# Altium project PCB_Project.PrjPcb
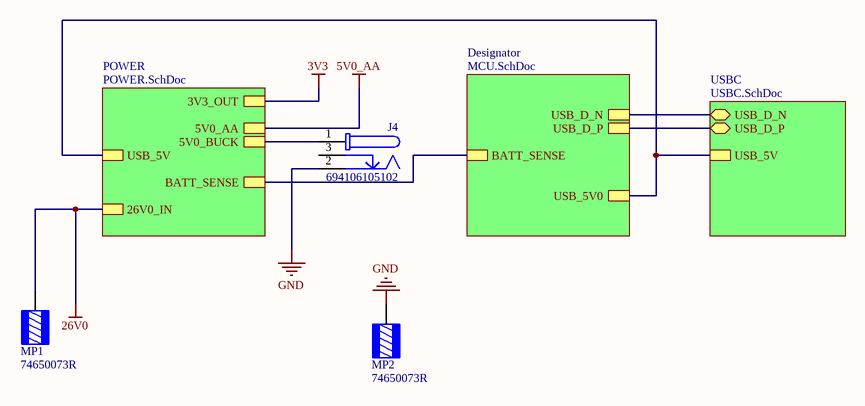
[diagram p0: TOP.SchDoc]
CAGE_CODE: ?????; CONTRACT_NUMBER: <CONTRACT NO>; DOC_NO_ASSY_DWG: <ASSY DWG NO>; DOC_NO_BOM: <BOM DOC NO>; DOC_NO_FAB_DWG: <FAB DWG NO>; DOC_NO_SCH_DWG: <SCH DWG NO>; PCB_2_DEC_TOL: +/-.01; PCB_3_DEC_TOL: +/-.010; PCB_ANG_TOL: +/-1/2; PCB_ASSEMBLY_NO: <PCB ASSY NO>; PCB_CHECKER: - -----; PCB_CHECKER_APP_DATE: --/--/----; PCB_DESIGNER: - -----; PCB_DESIGNER_APP_DATE: --/--/----; PCB_DWG_NO: <PCB DWG NO>; PCB_ENGINEER: - -----; PCB_ENGINEER_APP_DATE: --/--/----; PCB_PART_NUMBER: <PCB PN>; PCB_REV: A; SCH_REV: A
4 sheets, 64 parts. Net scope: hierarchical (ports join the sheet entries above them; power ports are global).
Board file: PCB1.PcbDoc
Sheets:
  TOP.SchDoc
    POWER = POWER.SchDoc
    Designator = MCU.SchDoc
    USBC = USBC.SchDoc

## Sheet TOP.SchDoc
size A4; SheetNumber: 1; SheetTotal: 4

### Parts
J4  694106105102  [694106105102]
MP1  74650073R  [WURTH 74650073]
MP2  74650073R  [WURTH 74650073]

### Sub-sheets
Designator = MCU.SchDoc: USB_D_N, USB_D_P, USB_5V0, BATT_SENSE
POWER = POWER.SchDoc: 26V0_IN, 5V0_AA, 3V3_OUT, USB_5V, BATT_SENSE, 5V0_BUCK
USBC = USBC.SchDoc: USB_D_N (bidir), USB_D_P (bidir), USB_5V

### Nets
26V0: MP1.1 ; sheet POWER/26V0_IN
GND: J4.2 MP2.1
5V_BUCK: J4.1 ; sheet POWER/5V0_BUCK
5V_USB: sheet POWER/USB_5V, sheet Designator/USB_5V0, sheet USBC/USB_5V
USB_D_N: sheet Designator/USB_D_N, sheet USBC/USB_D_N
USB_D_P: sheet Designator/USB_D_P, sheet USBC/USB_D_P
NetRbot_1: sheet POWER/BATT_SENSE, sheet Designator/BATT_SENSE

Not connected (* = marked no-connect by the designer): J4 3

### Library data of the parts
J4 = CMP-1502-00176-3: DC Power Jack Connector with Pegs WR-DC, Male, Right Angled, SMT, 5 A, 24 V; Voltage Rating: 24V; Insulation Resistance: 100MΩ; Current Rating: 5A; Shielding: Unshielded; Number of Contacts: 3; Contact Gender: Female; Min Operating Temperature: -40°C; REACH SVHC: Unknown; Flammability Rating: UL94 V-0; Contact Material: Gold; Housing Material: Polyamide; Operating Supply Voltage: 24V; Mount: Surface Mount; Packaging: Tape and Reel; Max Operating Temperature: 85°C; Termination: SMD/SMT; Height: 11.2mm; Voltage Rating (DC): 24V; Contact Plating: Tin; Connector Type: Power; Color: Black; Gender: Male; RoHS: Compliant
MP1 MP2 = 74650073R: TERM REDCUBE M3 4PIN PCB; Manufacturer: Würth Elektronik; Current Rating (Amps): 50 A; Part Number: 74650073R; ComponentLink1Description: Datasheet; ComponentLink1URL: https://katalog.we-online.de/em/datasheet/74650073R.pdf; ComponentLink2Description: DigiKey Link; ComponentLink2URL: https://www.digikey.com/en/products/detail/würth-elektronik/74650073R/6643978; Features: Screw not Included; LastUpdated: 8/7/2022 8:38:54 PM; Lifecycle Status: Active; Minimum Order: 1; Mounting Type: Through Hole; Number of Pins: 4; Packaging: TapeAndReel; Part Status: Active; Price: 2.28; Screw Size: M3; Series: REDCUBE WP-THRBU; Supplier 1: DigiKey; Supplier Part Number 1: 732-10882-1-ND; Terminal Type: Screw Terminal, Power Tap; Termination: Solder

## Sheet POWER.SchDoc
size A4; SheetNumber: 2; SheetTotal: 4
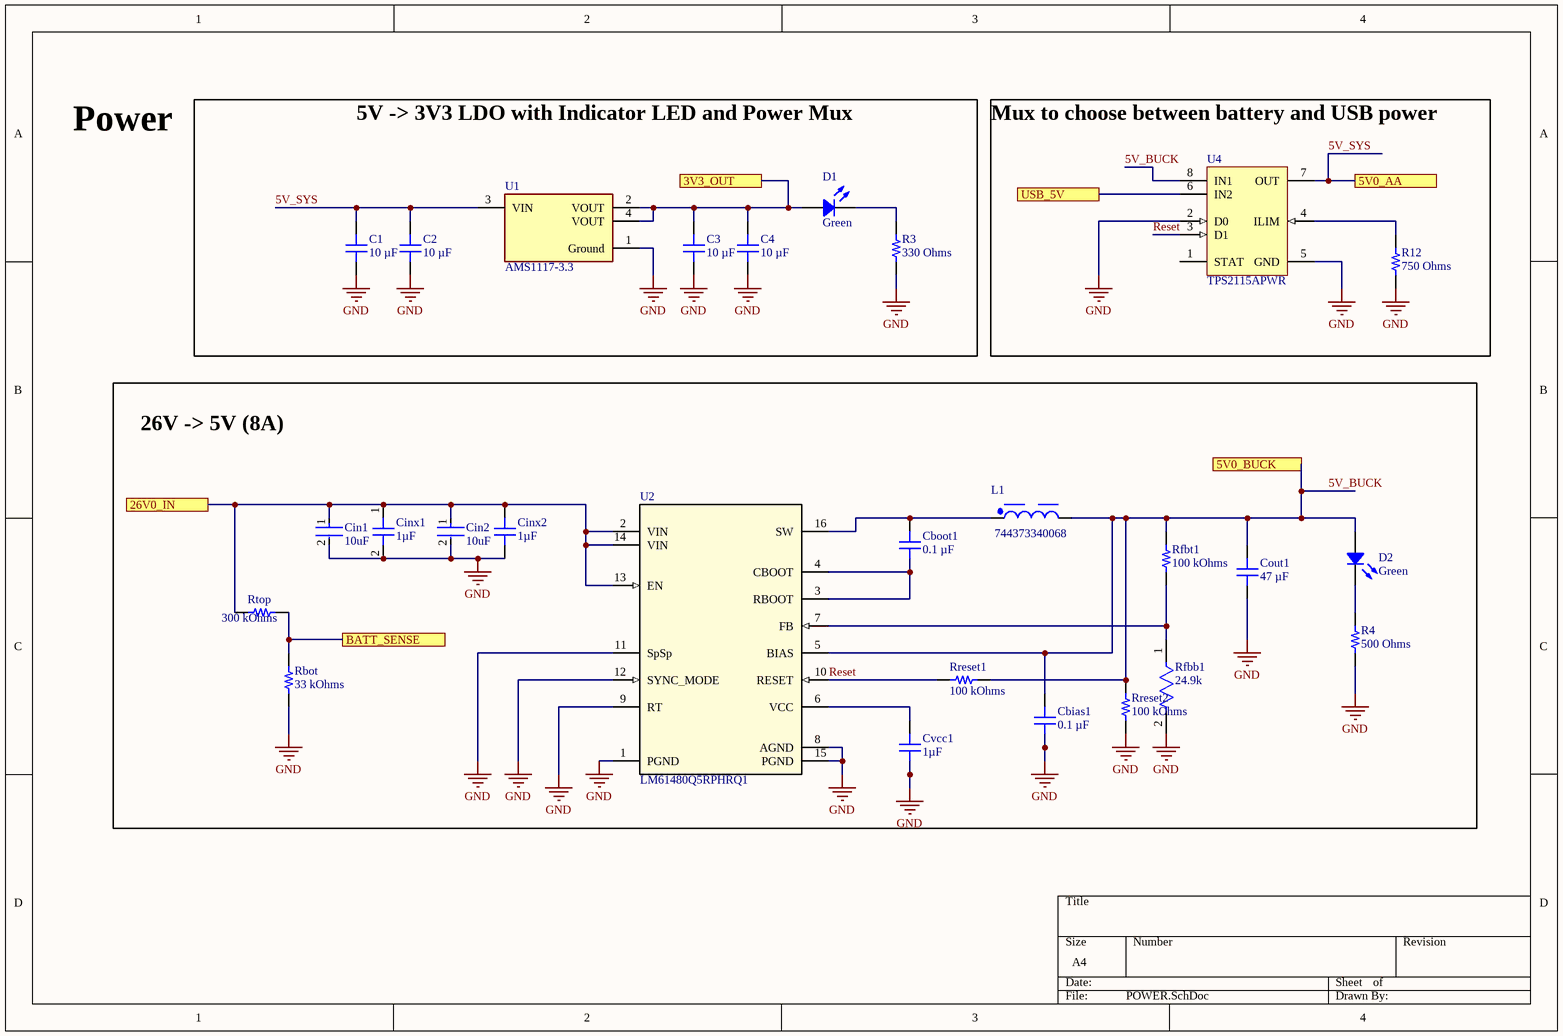
[diagram p1: POWER.SchDoc]

### Parts
C1  10 µF  [CAP 0603_1608]
C2  10 µF  [CAP 0603_1608]
C3  10 µF  [CAP 0603_1608]
C4  10 µF  [CAP 0603_1608]
Cbias1  0.1 µF  [CAP 0603_1608]
Cboot1  0.1 µF  [CAP 0603_1608]
Cin1  10uF  [FP-GRT31C-0_2-IPC_A]
Cin2  10uF  [FP-GRT31C-0_2-IPC_A]
Cinx1  1µF  [CAP 0603_1608]
Cinx2  1µF  [CAP 0603_1608]
Cout1  47 µF  [CAP 0603_1608]
Cvcc1  1µF  [CAP 0603_1608]
D1  Green  [LED 0603_1608 GREEN]
D2  Green  [LED 0603_1608 GREEN]
L1  744373340068  [WE-LHMI_5020]
R3  330 Ohms  [RES 0603_1608]
R4  500 Ohms  [RES 1206_3216]
R12  750 Ohms  [RES 0603_1608]
Rbot  33 kOhms  [YAGEO RES 0603_1608]
Rfbb1  24.9k  [FP-TFCR0603-IPC_A]
Rfbt1  100 kOhms  [RES 0603_1608]
Rreset1  100 kOhms  [RES 0603_1608]
Rreset2  100 kOhms  [RES 0603_1608]
Rtop  300 kOhms  [YAGEO RES 0603_1608]
U1  AMS1117-3.3  [FP-AMS1117-IPC_C]
U2  LM61480Q5RPHRQ1  [RPH0016A]
U4  TPS2115APWR  [PW0008A_N]

### Blocks framed on the sheet
5V -> 3V3 LDO with Indicator LED and Power Mux: C1-C4 D1 R3 U1
Mux to choose between battery and USB power: R12 U4
26V -> 5V (8A): Cbias1 Cboot1 Cin1 Cin2 Cinx1 Cinx2 Cout1 Cvcc1 D2 L1 R4 Rbot Rfbb1 Rfbt1 Rreset1 Rreset2 Rtop U2

### Ports
3V3_OUT, 5V0_AA, 5V0_BUCK, 26V0_IN, BATT_SENSE, USB_5V

### Nets
3V3: C3.2 C4.2 D1.1 U1.2(VOUT) U1.4(VOUT) ; port 3V3_OUT
5V_SYS: C1.2 C2.2 U1.3(VIN) U4.7(OUT) ; port 5V0_AA
26V0: Cin1.1 Cin2.1 Cinx1.1 Cinx2.1 Rtop.1 U2.2(VIN) U2.13(EN) U2.14(VIN) ; port 26V0_IN
GND: C1.1 C2.1 C3.1 C4.1 Cbias1.2 Cin1.2 Cin2.2 Cinx1.2 Cinx2.2 Cout1.2 Cvcc1.2 R3.1 R4.2 R12.2 Rbot.2 Rfbb1.2 Rreset2.2 U1.1(Ground) U2.1(PGND) U2.8(AGND) U2.9(RT) U2.11(SpSp) U2.12(SYNC_MODE) U2.15(PGND) U4.2(D0) U4.5(GND)
5V_BUCK: Cbias1.1 Cout1.1 D2.1 L1.2 Rfbt1.1 Rreset1.2 Rreset2.1 U2.5(BIAS) U4.8(IN1) ; port 5V0_BUCK
5V_USB: U4.6(IN2) ; port USB_5V
Reset: Rreset1.1 U2.10(RESET) U4.3(D1)
NetCboot1_1: Cboot1.1 L1.1 U2.16(SW)
NetCboot1_2: Cboot1.2 U2.3(RBOOT) U2.4(CBOOT)
NetCvcc1_1: Cvcc1.1 U2.6(VCC)
NetD1_2: D1.2 R3.2
NetD2_2: D2.2 R4.1
NetR12_1: R12.1 U4.4(ILIM)
NetRbot_1: Rbot.1 Rtop.2 ; port BATT_SENSE
NetRfbb1_1: Rfbb1.1 Rfbt1.2 U2.7(FB)

Not connected (* = marked no-connect by the designer): U4 1(STAT)

### Notes on the sheet
- Power

### Library data of the parts
C1-C4 = CM105X5R106K16AT: 0603 X5R 10UF10% 16V; manufacturer: KYOCERA AVX; Tolerance: ±10%; Part Number: CM105X5R106K16AT; Value: 10 µF; Applications: General Purpose; Capacitance: 10 µF; componentlink1description: Datasheet; componentlink1url: https://ele.kyocera.com/assets/products/capacitor/CM_Series_e.pdf; componentlink2description: DigiKey Link; componentlink2url: https://www.digikey.com/en/products/detail/kyocera-avx/CM105X5R106K16AT/17866311; Device Package: 0603 (1608 Metric); lastupdated: 2/9/2024 8:08:53 PM; Lifecycle Status: Active; Minimum Order: 1; Mounting Type: Surface Mount, MLCC; Operating Temperature: -55°C ~ 85°C; Package / Case: 0603 (1608 Metric); packaging: TapeAndReel; partid: 55416; Part Status: Active; price: 0.03; series: CM; Size / Dimension: 0.063" L x 0.031" W (1.60mm x 0.80mm); Supplier 1: DigiKey; Supplier Part Number 1: 478-CM105X5R106K16ATCT-ND; Temperature Coefficient: X5R; Thickness (Max): 0.039" (1.00mm); Voltage - Rated: 16V
Cbias1 Cboot1 = C0603C104K5RAC7411: CAP CER 0.1UF 50V X7R 0603; manufacturer: KEMET; Tolerance: ±10%; Part Number: C0603C104K5RAC7411; Capacitance: 0.1 µF; Applications: Bypass, Decoupling; componentlink1description: Datasheet; componentlink1url: https://api.kemet.com/component-edge/download/datasheet/C0603C104K5RAC7411.pdf; componentlink2description: DigiKey Link; componentlink2url: https://www.digikey.com/en/products/detail/kemet/C0603C104K5RAC7411/3317013; Device Package: 0603 (1608 Metric); lastupdated: 2024-02-09 8:10:30 PM; Lifecycle Status: Active; Minimum Order: 1; Mounting Type: Surface Mount, MLCC; Operating Temperature: -55°C ~ 125°C; Package / Case: 0603 (1608 Metric); packaging: TapeAndReel; partid: 2233; Part Status: Active; price: 0.01; series: SMD Comm X7R; Size / Dimension: 0.063" L x 0.031" W (1.60mm x 0.80mm); Supplier 1: DigiKey; Supplier Part Number 1: 399-C0603C104K5RAC7411CT-ND; Temperature Coefficient: X7R; Thickness (Max): 0.035" (0.90mm); value: 0.1 µF; Voltage - Rated: 50V
Cin1 Cin2 = CMP-06035-048951-1: CAP CER 10UF 50V X5R 1206; Tolerance: 20%; Length: 0.126inch; Mount: Surface Mount; Packaging: Tape and Reel; Capacitance: 10uF; Case/Package: 1206; Case Code (Imperial): 1206; Max Operating Temperature: 85°C; Voltage Rating: 50V; Ratings: AEC-Q200; Min Operating Temperature: -55°C; Thickness: 0.071inch; Width: 0.063inch; Case Code (Metric): 3216
Cinx1 Cinx2 Cvcc1 = 06035D105MAT2A: CAP CER 1UF 50V X5R 0603; manufacturer: AVX Corporation; Tolerance: ±20%; Part Number: 06035D105MAT2A; Capacitance: 1µF; Applications: General Purpose; componentlink1description: Datasheet; componentlink1url: http://datasheets.avx.com/cx5r.pdf; componentlink2description: DigiKey Link; componentlink2url: http://digikey.com/product-detail/en/avx-corporation/06035D105MAT2A/478-11443-1-ND/8019298; Device Package: 0603 (1608 Metric); lastupdated: 2020-09-02 1:03:34 AM; Lifecycle Status: Active; Minimum Order: 1; Mounting Type: Surface Mount, MLCC; Operating Temperature: -55°C ~ 85°C; Package / Case: 0603 (1608 Metric); packaging: TapeAndReel; partid: 3200; Part Status: Active; price: 0.05; series: -; Size / Dimension: 0.063" L x 0.032" W (1.60mm x 0.81mm); Supplier 1: DigiKey; Supplier Part Number 1: 478-11443-1-ND; Temperature Coefficient: X5R; Thickness (Max): 0.035" (0.90mm); value: 1µF; Voltage - Rated: 50V
Cout1 = CL10A476MQ8QRNC: CAP CER 47UF 6.3V X5R 0603; manufacturer: Samsung Electro-Mechanics; Tolerance: ±20%; Part Number: CL10A476MQ8QRNC; Capacitance: 47 µF; Applications: General Purpose; componentlink1description: Datasheet; componentlink1url: https://media.digikey.com/pdf/Data%20Sheets/Samsung%20PDFs/CL10A476MQ8QRNC_Spec.pdf; componentlink2description: DigiKey Link; componentlink2url: https://www.digikey.com/en/products/detail/samsung-electro-mechanics/CL10A476MQ8QRNC/10478988; Device Package: 0603 (1608 Metric); lastupdated: 2024-02-09 8:09:49 PM; Lifecycle Status: Active; Minimum Order: 1; Mounting Type: Surface Mount, MLCC; Operating Temperature: -55°C ~ 85°C; Package / Case: 0603 (1608 Metric); packaging: TapeAndReel; partid: 45940; Part Status: Active; price: 0.29; series: CL; Size / Dimension: 0.063" L x 0.031" W (1.60mm x 0.80mm); Supplier 1: DigiKey; Supplier Part Number 1: 1276-CL10A476MQ8QRNCCT-ND; Temperature Coefficient: X5R; Thickness (Max): 0.039" (1.00mm); value: 47 µF; Voltage - Rated: 6.3V
D1 D2 = 150060GS75003: LED GREEN CLEAR 0603 SMD; Manufacturer: Würth Elektronik; Current - Test: 20mA; Lens Color: Colorless; Lens Size: 1.10mm x 0.80mm; Lens Style: Rectangle with Flat Top; Millicandela Rating: 1600mcd; Viewing Angle: 140°; Voltage - Forward (Vf) (Typ): 3.2V; Wavelength - Dominant: 525nm; Wavelength - Peak: 515nm; Part Number: 150060GS75003; Color: Green; ComponentLink1Description: Datasheet; ComponentLink1URL: https://www.we-online.com/catalog/datasheet/150060GS75003.pdf; ComponentLink2Description: DigiKey Link; ComponentLink2URL: https://www.digikey.com/en/products/detail/würth-elektronik/150060GS75003/16022170; Device Package: 0603 (1608 Metric); Height (Max): 0.80mm; LastUpdated: 6/3/2024 7:58:49 PM; Lens Transparency: Clear; Lifecycle Status: Active; Minimum Order: 1; Mounting Type: Surface Mount; Package / Case: 0603 (1608 Metric); Packaging: TapeAndReel; PartId: 1111; Part Status: Active; Price: 0.18; Series: WL-SMCW; Size / Dimension: 1.60mm L x 0.80mm W; Supplier 1: DigiKey; Supplier Part Number 1: 732-150060GS75003CT-ND; Supplier Device Package: 0603; Value: Green
L1 = CMP-03913-52738382-5: We-lhmi Series, Shielded Wire-wound SMD Inductor 680 Nh +/-20% Wire-wound 6.8A I; Tolerance: 20%; Test Frequency: 100kHz; Inductance: 680nH; Self Resonant Frequency: 90MHz; Saturation Current: 9.8A; DC Resistance (DCR): 11mΩ; Core Material: Ferrite; Width: 5.2mm; Shielding: Shielded; Current Rating: 6.8A; REACH SVHC: Unknown; RMS Current (Irms): 6.8A; Max Operating Temperature: 125°C; Termination: SMD/SMT; Ambient Temperature Range Low: -40°C; Composition: Wirewound; Height: 1.8mm; Mount: Surface Mount; Max DC Current: 6.8A; Number of Pins: 2; Height - Seated (Max): 1.9812mm; Length: 5.7mm; Case/Package: SMD/SMT; Ambient Temperature Range High: 85°C; Inductance Tolerance: 20%; Min Operating Temperature: -40°C; RoHS: Compliant
R3 = ERA-3VEB3300V: RES 330 OHM 0.1% 1/8W 0603; Manufacturer: Panasonic Electronic Components; Power (Watts): 0.125W, 1/8W; Temperature Coefficient: ±25ppm/°C; Part Number: ERA-3VEB3300V; Value: 330 Ohms; ComponentLink1Description: Datasheet; ComponentLink1URL: https://b2b-api.panasonic.eu/file_stream/pids/fileversion/9152; ComponentLink2Description: DigiKey Link; ComponentLink2URL: https://www.digikey.com/en/products/detail/panasonic-electronic-components/ERA-3VEB3300V/12085193; Composition: Thin Film; Device Package: 0603 (1608 Metric); Features: Anti-Sulfur, Automotive AEC-Q200; Height - Seated (Max): 0.022" (0.55mm); LastUpdated: 2/9/2024 8:41:22 PM; Lifecycle Status: Active; Minimum Order: 1; Number of Terminations: 2; Operating Temperature: -55°C ~ 155°C; Package / Case: 0603 (1608 Metric); Packaging: TapeAndReel; PartId: 62303; Part Status: Active; Price: 0.10; Ratings: AEC-Q200; Resistance: 330 Ohms; Series: ERA-3V; Size / Dimension: 0.063" L x 0.031" W (1.60mm x 0.80mm); Supplier 1: DigiKey; Supplier Part Number 1: 10-ERA-3VEB3300VCT-ND; Supplier Device Package: 0603; Tolerance: ±0.1%
R4 = PLT1206Z5000AST5: RES SMD 500 OHM 0.05% 0.4W 1206; Manufacturer: Vishay Thin Film; Power (Watts): 0.4W, 2/5W; Temperature Coefficient: ±5ppm/°C; Part Number: PLT1206Z5000AST5; ComponentLink1Description: Datasheet; ComponentLink1URL: http://www.vishay.com/docs/60030/plt.pdf; ComponentLink2Description: DigiKey Link; ComponentLink2URL: http://digikey.com/product-detail/en/vishay-thin-film/PLT1206Z5000AST5/PLT1206-500ACT-ND/2120427; Composition: Thin Film; Device Package: 1206 (3216 Metric); Features: Anti-Corrosive, Flame Proof, Moisture Resistant, Safety; Height - Seated (Max): 0.033" (0.84mm); LastUpdated: 2024-02-09 8:54:28 PM; Lifecycle Status: Active; Minimum Order: 1; Number of Terminations: 2; Operating Temperature: -55°C ~ 125°C; Package / Case: 1206 (3216 Metric); Packaging: TapeAndReel; PartId: 30946; Part Status: Active; Price: 2.64; Resistance: 500 Ohms; Series: PLT; Size / Dimension: 0.126" L x 0.063" W (3.20mm x 1.60mm); Supplier 1: DigiKey; Supplier Part Number 1: PLT1206-500ACT-ND; Supplier Device Package: 1206; Tolerance: ±0.05%; Value: 500 Ohms
R12 = CPF0603F750RC1: RES SMD 750 OHM 1% 1/16W 0603; Manufacturer: TE Connectivity Passive Product; Power (Watts): 0.063W, 1/16W; Temperature Coefficient: ±50ppm/°C; Part Number: CPF0603F750RC1; Value: 750 Ohms; ComponentLink1Description: Datasheet; ComponentLink1URL: https://www.te.com/commerce/DocumentDelivery/DDEController?Action=srchrtrv&DocNm=1773200&DocType=DS&DocLang=English; ComponentLink2Description: DigiKey Link; ComponentLink2URL: https://www.digikey.com/en/products/detail/te-connectivity-passive-product/CPF0603F750RC1/2384377; Composition: Thin Film; Device Package: 0603 (1608 Metric); Height - Seated (Max): 0.022" (0.55mm); LastUpdated: 2024-02-09 8:43:28 PM; Lifecycle Status: Active; Minimum Order: 1; Number of Terminations: 2; Operating Temperature: -55°C ~ 155°C; Package / Case: 0603 (1608 Metric); Packaging: TapeAndReel; PartId: 7040; Part Status: Active; Price: 0.02; Resistance: 750 Ohms; Series: CPF, Neohm; Size / Dimension: 0.061" L x 0.031" W (1.55mm x 0.80mm); Supplier 1: DigiKey; Supplier Part Number 1: A102316CT-ND; Supplier Device Package: 0603; Tolerance: ±1%
Rbot = RT0603FRE0733KL: RES SMD 33K OHM 1% 1/10W 0603; Manufacturer: Yageo; Power (Watts): 0.1W, 1/10W; Temperature Coefficient: ±50ppm/°C; Part Number: RT0603FRE0733KL; Value: 33 kOhms; ComponentLink1Description: Datasheet; ComponentLink1URL: https://www.yageo.com/upload/media/product/productsearch/datasheet/rchip/PYu-RT_1-to-0.01_RoHS_L_11.pdf; ComponentLink2Description: DigiKey Link; ComponentLink2URL: https://www.digikey.com/en/products/detail/yageo/RT0603FRE0733KL/1075313; Composition: Thin Film; Device Package: 0603 (1608 Metric); Height - Seated (Max): 0.022" (0.55mm); LastUpdated: 2024-07-25 9:19:32 AM; Lifecycle Status: Active; Minimum Order: 1; Number of Terminations: 2; Operating Temperature: -55°C ~ 155°C; Package / Case: 0603 (1608 Metric); Packaging: TapeAndReel; PartId: 5680; Part Status: Active; Price: 0.01; Resistance: 33 kOhms; Series: RT; Size / Dimension: 0.063" L x 0.031" W (1.60mm x 0.80mm); Supplier 1: DigiKey; Supplier Part Number 1: YAG5959CT-ND; Supplier Device Package: 0603; Tolerance: ±1%
Rfbb1 = CMP-250906-231724-1: RES Thin Film,  24.9kΩ, 1%, 0.1W, 50ppm/°C, 0603
Rfbt1 Rreset1 Rreset2 = RNCS0603BKE100K: RES 100K OHM 0.1% 1/16W 0603; Manufacturer: Stackpole Electronics Inc; Power (Watts): 0.063W, 1/16W; Temperature Coefficient: ±25ppm/°C; Part Number: RNCS0603BKE100K; Value: 100 kOhms; ComponentLink1Description: Datasheet; ComponentLink1URL: https://www.seielect.com/catalog/sei-rncs_rnch.pdf; ComponentLink2Description: DigiKey Link; ComponentLink2URL: https://www.digikey.com/en/products/detail/stackpole-electronics-inc/RNCS0603BKE100K/1708835; Composition: Thin Film; Device Package: 0603 (1608 Metric); Features: Anti-Corrosive, Automotive AEC-Q200, Moisture Resistant; Height - Seated (Max): 0.022" (0.55mm); LastUpdated: 2024-02-09 8:43:37 PM; Lifecycle Status: Active; Minimum Order: 1; Number of Terminations: 2; Operating Temperature: -55°C ~ 155°C; Package / Case: 0603 (1608 Metric); Packaging: TapeAndReel; PartId: 4849; Part Status: Active; Price: 0.06; Ratings: AEC-Q200; Resistance: 100 kOhms; Series: RNCS; Size / Dimension: 0.061" L x 0.031" W (1.55mm x 0.80mm); Supplier 1: DigiKey; Supplier Part Number 1: RNCS0603BKE100KCT-ND; Supplier Device Package: 0603; Tolerance: ±0.1%
Rtop = RC0603FR-07300KL: RES 300K OHM 1% 1/10W 0603; Manufacturer: Yageo; Power (Watts): 0.1W, 1/10W; Temperature Coefficient: ±100ppm/°C; Part Number: RC0603FR-07300KL; Value: 300 kOhms; ComponentLink1Description: Datasheet; ComponentLink1URL: https://www.yageo.com/upload/media/product/productsearch/datasheet/rchip/PYu-RC_Group_51_RoHS_L_10.pdf; ComponentLink2Description: DigiKey Link; ComponentLink2URL: https://www.digikey.com/en/products/detail/yageo/RC0603FR-07300KL/727145; Composition: Thick Film; Device Package: 0603 (1608 Metric); Features: Moisture Resistant; Height - Seated (Max): 0.022" (0.55mm); LastUpdated: 2024-07-25 9:19:32 AM; Lifecycle Status: Active; Minimum Order: 1; Number of Terminations: 2; Operating Temperature: -55°C ~ 155°C; Package / Case: 0603 (1608 Metric); Packaging: CutTape; PartId: 7517; Part Status: Active; Price: 0.01; Resistance: 300 kOhms; Series: RC_L; Size / Dimension: 0.063" L x 0.031" W (1.60mm x 0.80mm); Supplier 1: DigiKey; Supplier Part Number 1: 311-300KHRCT-ND; Supplier Device Package: 0603; Tolerance: ±1%
U1 = CMP-209535-000001-1: LDO Voltage Regulators 1A, 3.3V; Manufacturer: Advanced Monolithic Systems; Dropout Voltage: 1.1V; Output Type: Fixed; Nominal Supply Current: 5mA; Max Power Dissipation: 1.2W; Max Supply Voltage: 15V; Number Of Outputs: 1; Standoff Height: 0.64mm; Max Junction Temp: +125°C; Height: 1.8mm; Package: AMS1117; Device Class L2: Power Management ICs; ComponentLink2Description: Datasheet; ComponentLink2URL: http://www.advanced-monolithic.com/pdf/ds1117.pdf; Category: IC; RoHS: TRUE; Automotive: No; Device Class L1: Integrated Circuits (ICs); Output Current: 1A; Device Class L3: Voltage Regulators - Linear; Temperature: -40°C to +125°C; Output Voltage: 3.3V; Manufacturer Part Number: AMS1117-3.3; Temperature Range Low: -40°C; Octopart: https://octopart.com/ams1117-3.3-advanced+monolithic+systems-25899300; Lead Free: Yes; Ipc Land Pattern Name: SOT229P700X180-4; Temperature Range High: +125°C
U2 = LM61480Q5RPHRQ1: Automotive 8A buck converter optimized for power density and low EMI 16-VQFN-HR -40 to 150; Manufacturer_Name: Texas Instruments; TYPE: TYPE; RefDes: RefDes; Copyright: Copyright (C) 2025 Ultra Librarian. All rights reserved.; Manufacturer_Part_Number: LM61480Q5RPHRQ1; Supplier 1: DigiKey; Supplier Part Number 1: 296-LM61480Q5RPHRQ1CT-ND
U4 = CMP-0339-00018-2: Dual In / Single Out Autoswitching Power Mux, 2.8 to 5.5 V, -40 to 85 degC, 8-pin TSSOP (PW), Green (RoHS & no Sb/Br); Manufacturer: Texas Instruments; SubFamily: Power Multiplexer (MUX); IN2 rDS(on)(Typ)(Ohms): 0.084; Number of Inputs: 2; IN1, IN2 Input Voltage(Max)(V): 5.5; IN1, IN2 Input Voltage(Min)(V): 2.8; IN1 rDS(on)(Typ)(mOhm): 84; IN2 Output Current(Max)(A): 1.25; PackageDescription: 8-Pin Plastic Thin Small Outline Package 3 x 4.4 mm Body ,0.65 mm Pitch; PackageVersion: revG, Feb-2011; ComponentLink1Description: Datasheet; Mounting Technology: Surface Mount; PartNumber: TPS2115APWR; DatasheetVersion: SBVS044F; Eco-Plan: Green (RoHS & no Sb/Br); Code_JEDEC: MO-153; PackageReference: PW0008A; IN1 Output Current(Max)(A): 1.25; ComponentLink1URL: http://www.ti.com/general/docs/lit/getliterature.tsp?genericPartNumber=TPS2115A&fileType=pdf

## Sheet MCU.SchDoc
size A4; SheetNumber: 4; SheetTotal: 4
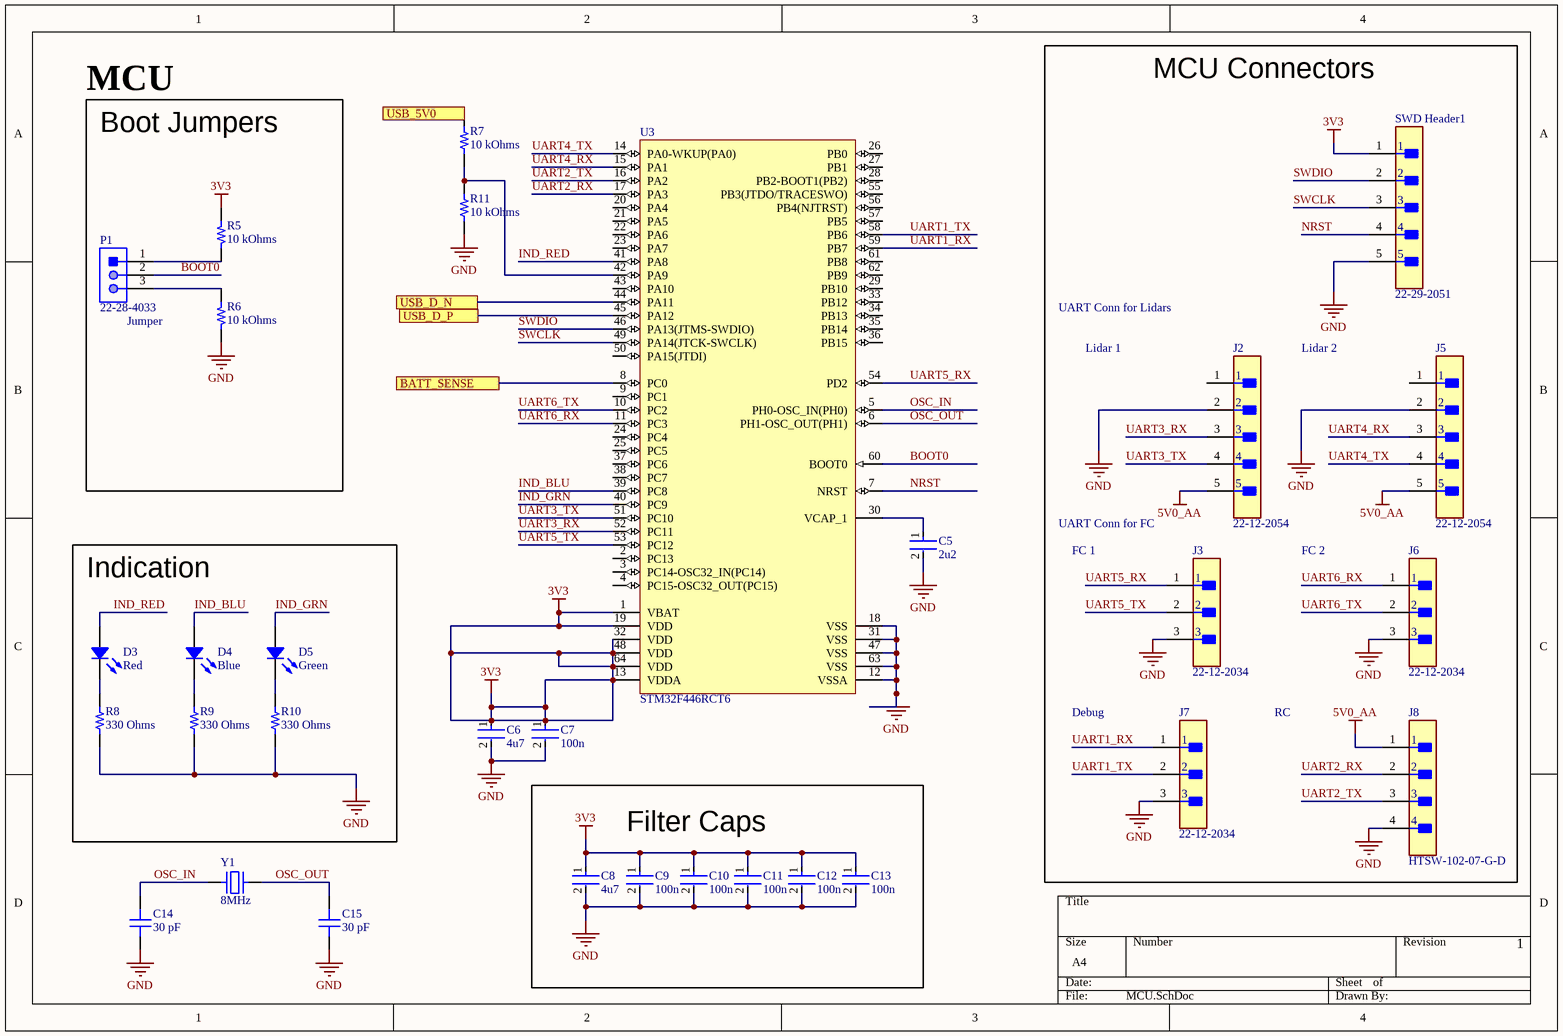
[diagram p2: MCU.SchDoc]

### Parts
C5  2u2  [FP-CL10-IPC_C]
C6  4u7  [FP-CL10-IPC_C]
C7  100n  [FP-CL779-IPC_C]
C8  4u7  [FP-CL10-IPC_C]
C9  100n  [FP-CL779-IPC_C]
C10  100n  [FP-CL779-IPC_C]
C11  100n  [FP-CL779-IPC_C]
C12  100n  [FP-CL779-IPC_C]
C13  100n  [FP-CL779-IPC_C]
C14  30 pF  [CAP 0603_1608]
C15  30 pF  [CAP 0603_1608]
D3  Red  [LED 0603_1608 RED]
D4  Blue  [LED 0603_1608 BLUE]
D5  Green  [LED 0603_1608 GREEN]
J2  22-12-2054  [FP-22-12-2054-MFG]
J3  22-12-2034  [FP-22-12-2034-MFG]
J5  22-12-2054  [FP-22-12-2054-MFG]
J6  22-12-2034  [FP-22-12-2034-MFG]
J7  22-12-2034  [FP-22-12-2034-MFG]
J8  HTSW-102-07-G-D  [FP-HTSW-102-07-G-D-MFG]
P1  22-28-4033  [MOLX-22-28-4033_V]
R5  10 kOhms  [RES 0603_1608]
R6  10 kOhms  [RES 0603_1608]
R7  10 kOhms  [RES 0603_1608]
R8  330 Ohms  [RES 0603_1608]
R9  330 Ohms  [RES 0603_1608]
R10  330 Ohms  [RES 0603_1608]
R11  10 kOhms  [RES 0603_1608]
SWD_Header1  22-29-2051  [FP-22-29-2051-MFG]
U3  STM32F446RCT6  [STM-LQFP64_L]
Y1  8MHz  [TXC 9C]

### Blocks framed on the sheet
MCU Connectors: J2 J3 J5-J8 SWD_Header1
MCU: P1 R5 R6
Indication: D3-D5 R8-R10
Filter Caps: C8-C13

### Ports
BATT_SENSE, USB_5V0, USB_D_N, USB_D_P

### Nets
3V3: C6.1 C7.1 C8.1 C9.1 C10.1 C11.1 C12.1 C13.1 R5.1 SWD_Header1.1 U3.1(VBAT) U3.13(VDDA) U3.19(VDD) U3.32(VDD) U3.48(VDD) U3.64(VDD)
5V0_AA: J2.5 J5.5 J8.1  [project net 5V_SYS]
GND: C5.2 C6.2 C7.2 C8.2 C9.2 C10.2 C11.2 C12.2 C13.2 C14.1 C15.1 J2.2 J3.3 J5.2 J6.3 J7.3 J8.4 R6.1 R8.1 R9.1 R10.1 R11.1 SWD_Header1.5 U3.12(VSSA) U3.18(VSS) U3.31(VSS) U3.47(VSS) U3.63(VSS)
5V_USB: R7.2 ; port USB_5V0
BOOT0: P1.2 U3.60(BOOT0)
IND_BLU: D4.1 U3.39(PC8)
IND_GRN: D5.1 U3.40(PC9)
IND_RED: D3.1 U3.41(PA8)
NRST: SWD_Header1.4 U3.7(NRST)
OSC_IN: C14.2 U3.5(PH0-OSC_IN(PH0)) Y1.1
OSC_OUT: C15.2 U3.6(PH1-OSC_OUT(PH1)) Y1.2
SWCLK: SWD_Header1.3 U3.49(PA14(JTCK-SWCLK))
SWDIO: SWD_Header1.2 U3.46(PA13(JTMS-SWDIO))
UART1_RX: J7.1 U3.59(PB7)
UART1_TX: J7.2 U3.58(PB6)
UART2_RX: J8.2 U3.17(PA3)
UART2_TX: J8.3 U3.16(PA2)
UART3_RX: J2.3 U3.52(PC11)
UART3_TX: J2.4 U3.51(PC10)
UART4_RX: J5.3 U3.15(PA1)
UART4_TX: J5.4 U3.14(PA0-WKUP(PA0))
UART5_RX: J3.1 U3.54(PD2)
UART5_TX: J3.2 U3.53(PC12)
UART6_RX: J6.1 U3.11(PC3)
UART6_TX: J6.2 U3.10(PC2)
USB_D_N: U3.44(PA11) ; port USB_D_N
USB_D_P: U3.45(PA12) ; port USB_D_P
NetC5_1: C5.1 U3.30(VCAP_1)
NetD3_2: D3.2 R8.2
NetD4_2: D4.2 R9.2
NetD5_2: D5.2 R10.2
NetP1_1: P1.1 R5.2
NetP1_3: P1.3 R6.2
NetR7_1: R7.1 R11.2 U3.42(PA9)
NetRbot_1: U3.8(PC0) ; port BATT_SENSE

Not connected (* = marked no-connect by the designer): J2 1; J5 1; U3 2(PC13) 3(PC14-OSC32_IN(PC14)) 4(PC15-OSC32_OUT(PC15)) 9(PC1) 20(PA4) 21(PA5) 22(PA6) 23(PA7) 24(PC4) 25(PC5) 26(PB0) 27(PB1) 28(PB2-BOOT1(PB2)) 29(PB10) 33(PB12) 34(PB13) 35(PB14) 36(PB15) 37(PC6) 38(PC7) 43(PA10) 50(PA15(JTDI)) 55(PB3(JTDO/TRACESWO)) 56(PB4(NJTRST)) 57(PB5) 61(PB8) 62(PB9)

### Notes on the sheet
- Boot Jumpers
- UART Conn for Lidars
- (near P1) Jumper
- Lidar 1
- Lidar 2
- UART Conn for FC
- FC 1
- FC 2
- Debug
- RC
- 1

### Library data of the parts
C5 C6 C8 = CMP-13271-003017-1: Cap Ceramic 4.7uF 10V X5R ±10% Pad SMD 0603 +85°C T/R; Capacitance: 4.7uF; Case/Package: 0603; Packaging: Tape and Reel; Width: 0.031inch; Contact Plating: Tin; Thickness: 0.035inch; Package Quantity: 1; Voltage Rating: 10V; Case Code (Metric): 1608; Case Code (Imperial): 0603; Depth: 0.8mm; Height: 0.8mm; Tolerance: 10%; Max Operating Temperature: 85°C; Length: 1.6mm; Dielectric: X5R; Mount: Surface Mount; Radiation Hardening: No; Min Operating Temperature: -55°C
C7 C9-C13 = CMP-13271-002336-1: Cap Ceramic 100nF 50V X7R ±10% SMD 0402 +125°C Paper T/R
C14 C15 = 0603N300J500CT: CAP CER 30PF 50V C0G/NP0 0603; manufacturer: Walsin Technology Corporation; Temperature Coefficient: C0G, NP0; Tolerance: ±5%; Part Number: 0603N300J500CT; Value: 30 pF; Applications: General Purpose; Capacitance: 30 pF; componentlink1description: Datasheet; componentlink1url: http://www.passivecomponent.com/wp-content/uploads/2018/10/MLCC.pdf; componentlink2description: DigiKey Link; componentlink2url: https://www.digikey.com/en/products/detail/walsin-technology-corporation/0603N300J500CT/9355012; Device Package: 0603 (1608 Metric); lastupdated: 2/9/2024 8:10:20 PM; Lifecycle Status: Active; Minimum Order: 1; Mounting Type: Surface Mount, MLCC; Operating Temperature: -55°C ~ 125°C; Package / Case: 0603 (1608 Metric); packaging: TapeAndReel; partid: 9974; Part Status: Active; price: 0.01; series: -; Size / Dimension: 0.063" L x 0.031" W (1.60mm x 0.80mm); Supplier 1: DigiKey; Supplier Part Number 1: 1292-1515-1-ND; Thickness (Max): 0.034" (0.87mm); Voltage - Rated: 50V
D3 = 19-213SDRC/S259/TR8: LED RED CLEAR 2SMD; Manufacturer: Everlight Electronics Co Ltd; Configuration: Standard; Current - Test: 10mA; Lens Color: Colorless; Lens Size: 1.20mm x 0.80mm; Lens Style: Rectangle with Flat Top; Viewing Angle: 120°; Voltage - Forward (Vf) (Typ): 2V; Wavelength - Peak: 650nm; Part Number: 19-213SDRC/S259/TR8; Color: Red; ComponentLink1Description: Datasheet; ComponentLink1URL: //media.digikey.com/pdf/Data%20Sheets/Everlight%20PDFs/19-213SDRC-S259-TR8.pdf; ComponentLink2Description: DigiKey Link; ComponentLink2URL: http://digikey.com/product-detail/en/everlight-electronics-co-ltd/19-213SDRC-S259-TR8/1080-1580-1-ND/8535303; Device Package: 0603 (1608 Metric); Height (Max): 0.70mm; LastUpdated: 6/3/2024 7:59:48 PM; Lens Transparency: Clear; Lifecycle Status: Active; Minimum Order: 1; Mounting Type: Surface Mount; Package / Case: 0603 (1608 Metric); Packaging: TapeAndReel; PartId: 372; Part Status: Active; Price: 0.06; Series: -; Size / Dimension: 1.60mm L x 0.80mm W; Supplier 1: DigiKey; Supplier Part Number 1: 1080-1580-1-ND; Supplier Device Package: 2-SMD; Value: Red
D4 = 19-213SUBC/S400-A5/S208-2/TR8: LED BLUE CLEAR 2SMD; Manufacturer: Everlight Electronics Co Ltd; Configuration: Standard; Current - Test: 5mA; Lens Color: Colorless; Lens Size: 1.20mm x 0.80mm; Lens Style: Rectangle with Flat Top; Viewing Angle: 120°; Voltage - Forward (Vf) (Typ): 2.9V; Wavelength - Peak: 468nm; Part Number: 19-213SUBC/S400-A5/S208-2/TR8; Color: Blue; ComponentLink1Description: Datasheet; ComponentLink1URL: //media.digikey.com/pdf/Data%20Sheets/Everlight%20PDFs/19-213SUBC-S400-A5-S208-2-TR8.pdf; ComponentLink2Description: DigiKey Link; ComponentLink2URL: https://www.digikey.com/en/products/detail/everlight-electronics-co-ltd/19-213SUBC-S400-A5-S208-2-TR8/8535275; Device Package: 0603 (1608 Metric); Height (Max): 0.70mm; LastUpdated: 6/3/2024 7:57:52 PM; Lens Transparency: Clear; Lifecycle Status: Active; Minimum Order: 1; Mounting Type: Surface Mount; Package / Case: 0603 (1608 Metric); Packaging: TapeAndReel; PartId: 808; Part Status: Active; Price: 0.05; Series: -; Size / Dimension: 1.60mm L x 0.80mm W; Supplier 1: DigiKey; Supplier Part Number 1: 1080-1581-1-ND; Supplier Device Package: 2-SMD; Value: Blue
D5 = 150060GS55040: LED GREEN DIFFUSED 0603 SMD; Manufacturer: Würth Elektronik; Configuration: Standard; Current - Test: 20mA; Lens Color: 0.50mm; Lens Size: 1.00mm x 0.80mm; Lens Style: Rectangle with Flat Top; Millicandela Rating: 430mcd; Viewing Angle: 140°; Voltage - Forward (Vf) (Typ): 3.2V; Wavelength - Dominant: 525nm; Wavelength - Peak: 520nm; Part Number: 150060GS55040; Color: Green; ComponentLink1Description: Datasheet; ComponentLink1URL: https://www.we-online.de/web/en/index.php/download/media/07_electronic_components/download_center_1/application_notes_berichte/ano002_leds___the_future_of_horticultural_lighting/ANO002b_EN_LEDs_The_Future_of_Horticultural_Lighting.pdf; ComponentLink2Description: DigiKey Link; ComponentLink2URL: https://www.digikey.com/en/products/detail/würth-elektronik/150060GS55040/8557179; Device Package: 0603 (1608 Metric); Height (Max): 0.50mm; LastUpdated: 6/3/2024 7:58:52 PM; Lens Transparency: Diffused; Lifecycle Status: Active; Minimum Order: 1; Mounting Type: Surface Mount; Package / Case: 0603 (1608 Metric); Packaging: TapeAndReel; PartId: 673; Part Status: Active; Price: 0.14; Series: WL-SMCD; Size / Dimension: 1.60mm L x 0.80mm W; Supplier 1: DigiKey; Supplier Part Number 1: 732-12014-1-ND; Supplier Device Package: 0603 (1608 Metric); Value: Green
J2 J5 = CMP-00257-00024825-1: 22-12-2054 KK® 254 Solid Header, Right Angle, with Friction Lock, 5 Circuits, 0.51µm Gold (Au) Plating; NexarPartId: 24825; Contact Resistance: 10mΩ; Voltage Rating: 250V; Pitch: 2.54mm; Current Rating: 4A; Number of Circuits: 5; Approvals: CSA, UL; Insulation Resistance: 50GΩ; Glow Wire Compliant: Non-compliant; Gender: Male; Termination: Through Hole; Max Operating Temperature: 75°C; RoHS: Compliant; Orientation: Right Angle; Color: White; Housing Material: Nylon; Lead Pitch: 2.54mm; Halogen Free: Low Halogen; Packaging: Bulk; Voltage Rating (DC): 250V; Number of Contacts: 5; Lead Free: Contains Lead; Contact Plating: Gold; Flammability Rating: UL94 V-0; Radiation Hardening: No; Number of Positions: 5; Min Operating Temperature: 0°C; Housing Color: White; REACH SVHC: Unknown; Schedule B: 8536694040; Number of Rows: 1; Mount: Through Hole; Contact Material: Brass
J3 J6 J7 = CMP-04776-000587-1: CONN HEADER R/A 3POS 2.54MM; Approvals: UL; Contact Resistance: 10mR; Connector Type: Male Pin; Number of Circuits: 3; Voltage Rating: 250V; Gender: Male; Current Rating: 4A; Max Current Rating: 3A; Pitch: 2.54mm; RoHS Compliant: Yes; Contact Type: Male Pin; Housing Color: White; Orientation: Right Angle; Min Operating Temperature: 0°C; Depth: 12.83mm; Flammability Rating: UL94 V-0; Height: 2.03mm; Max Operating Temperature: 75°C; Number of Contacts: 3; Mount: Through Hole; Housing Material: Nylon; Number of Positions: 3; Series: KK® 7478; Max Voltage Rating (AC): 250V; Packaging: Bulk; Radiation Hardening: No; Length: 7.62mm; Contact Plating: Gold; Fastening Type: Friction; Contact Material: Brass; Color: White; Contact Mating Length: 0.264inch; Termination: Solder; Number of Rows: 1
J8 = CMP-02766-000010-1: CONN HEADER VERT 4POS 2.54MM; Manufacturer: Samtec; Voltage Rating: 550V; Conn Orientation: Straight; Number Of Contacts: 4; Description: Connector Header Through Hole 4 position 0.100" (2.54mm); Conn Gender: Male; Current Rating: 6.3A; Number Of Rows: 2; Category: Conn; Temperature: -55°C to +125°C; Automotive: No; Digikey Description: CONN HEADER VERT 4POS 2.54MM; ComponentLink2URL: http://suddendocs.samtec.com/catalog_english/htsw_th.pdf; Device Class L2: Headers and Wire Housings; Mouser Description: Conn Unshrouded Header HDR 4 POS 2.54mm Solder ST Thru-Hole Bag; Manufacturer Part Number: HTSW-102-07-G-D; Temperature Range High: +125°C; Contact Material: Gold,Nickel; Temperature Range Low: -55°C; ComponentLink2Description: Datasheet; Device Class L1: Connectors; Pitch: 2.54mm; Octopart: https://octopart.com/htsw-102-07-g-d-samtec-10531767; RoHS: TRUE; Package: HTSW-102-07-G-D; Lead Free: Yes; Device Class L3: unset; Height: 8.71mm
P1 = CMP-1676-00001-5: Male Header, Pitch 2.54 mm, 1 x 3 Position, Height 8.38 mm, Tail Length 3.18 mm, RoHS, Bulk; Manufacturer: Molex; Rows: 1; Voltage Rating: 250 V; Current Rating: 4 A; Min Operating Temperature: 0 degC; Lead Pitch: 0.1 inch; Packaging: Bulk; Contact Finish: Gold; RoHSCompliant: true; Contact Material: Brass; PackageReference: 22-28-4033; REACH SVHC: Unknown; PackageDescription: Male Header, Pitch 2.54 mm, 1 x 3 Position, Height 8.38 mm, Tail Length 3.18 mm; ComponentLink2URL: http://www.molex.com/pdm_docs/sd/022284033_sd.pdf; Height: 8.38 mm; Mounting Technology: Through Hole; ComponentLink1Description: Manufacturer URL; Length: 7.62 mm; Mount: Through Hole; DatasheetVersion: Rev. G, 01/2012; Max Operating Temperature: 75 degC; ComponentLink2Description: Datasheet; Colour: Black; Pins: 3; Contact Plating: Gold; Package Quantity: 1; ComponentLink1URL: http://www.molex.com/
R5 R6 = P2TC0603D1002LNTA: P2TC0603 2PPM/C 10K 0,01% N TA; Manufacturer: Vishay Sfernice; Power (Watts): 0.125W, 1/8W; Temperature Coefficient: ±2ppm/°C; Tolerance: ±0.01%; Part Number: P2TC0603D1002LNTA; Value: 10 kOhms; ComponentLink1Description: Datasheet; ComponentLink1URL: https://www.vishay.com/docs/53080/p2tc.pdf; ComponentLink2Description: DigiKey Link; ComponentLink2URL: https://www.digikey.com/en/products/detail/vishay-sfernice/P2TC0603D1002LNTA/11657673; Composition: Thin Film; Device Package: 0603 (1608 Metric); Features: Anti-Sulfur, Moisture Resistant; Height - Seated (Max): 0.025" (0.63mm); LastUpdated: 2/9/2024 8:41:20 PM; Lifecycle Status: Active; Minimum Order: 1; Number of Terminations: 2; Operating Temperature: -55°C ~ 155°C; Package / Case: 0603 (1608 Metric); Packaging: TapeAndReel; PartId: 62108; Part Status: Active; Price: 11.51; Resistance: 10 kOhms; Series: P2TC; Size / Dimension: 0.060" L x 0.033" W (1.52mm x 0.85mm); Supplier 1: DigiKey; Supplier Part Number 1: 716-P2TC0603D1002LNTACT-ND; Supplier Device Package: 0603
R7 R11 = APC0603B10K0N: 1/16 WATTS PRECISION CHIP 10 KIL; Manufacturer: Ohmite; Power (Watts): 0.063W, 1/16W; Temperature Coefficient: ±25ppm/°C; Tolerance: ±0.1%; Part Number: APC0603B10K0N; Value: 10 kOhms; ComponentLink1Description: Datasheet; ComponentLink1URL: https://www.ohmite.com/assets/docs/APC-1-15.34.pdf; ComponentLink2Description: DigiKey Link; ComponentLink2URL: https://www.digikey.com/en/products/detail/ohmite/APC0603B10K0N/16369646; Composition: Thin Film; Device Package: 0603 (1608 Metric); Height - Seated (Max): 0.022" (0.55mm); LastUpdated: 2/9/2024 8:40:41 PM; Lifecycle Status: Active; Minimum Order: 1; Number of Terminations: 2; Operating Temperature: -55°C ~ 155°C; Package / Case: 0603 (1608 Metric); Packaging: TapeAndReel; PartId: 77923; Part Status: Active; Price: 0.05; Resistance: 10 kOhms; Series: APC; Size / Dimension: 0.061" L x 0.031" W (1.55mm x 0.80mm); Supplier 1: DigiKey; Supplier Part Number 1: 273-APC0603B10K0NCT-ND; Supplier Device Package: 0603
R8-R10 = RCC0603330RFKEA: RCC0603 100 330R 1% ET1 E3; Manufacturer: Vishay Dale; Power (Watts): 0.2W, 1/5W; Temperature Coefficient: ±100ppm/°C; Part Number: RCC0603330RFKEA; Value: 330 Ohms; ComponentLink1Description: Datasheet; ComponentLink1URL: https://www.vishay.com/docs/20066/rcce3.pdf; ComponentLink2Description: DigiKey Link; ComponentLink2URL: https://www.digikey.com/en/products/detail/vishay-dale/RCC0603330RFKEA/12084212; Composition: Thick Film; Device Package: 0603 (1608 Metric); Features: Automotive AEC-Q200; Height - Seated (Max): 0.020" (0.50mm); LastUpdated: 2/9/2024 8:41:26 PM; Lifecycle Status: Active; Minimum Order: 1; Number of Terminations: 2; Operating Temperature: -55°C ~ 155°C; Package / Case: 0603 (1608 Metric); Packaging: TapeAndReel; PartId: 62920; Part Status: Active; Price: 0.01; Ratings: AEC-Q200; Resistance: 330 Ohms; Series: RCC e3; Size / Dimension: 0.061" L x 0.033" W (1.55mm x 0.85mm); Supplier 1: DigiKey; Supplier Part Number 1: 541-RCC0603330RFKEACT-ND; Supplier Device Package: 0603; Tolerance: ±1%
SWD_Header1 = CMP-04776-000816-1: 2.54MM KK HDR VT FRICLK VRA .5AU; Number of Circuits: 5; Connector Type: Male Pin; Max Current Rating: 7A; Glow Wire Compliant: Non-compliant; Insulation Resistance: 50GR; Gender: Male; Current Rating: 4A; Number of Lines: 1; Max Voltage Rating (AC): 250V; Contact Resistance: 10mR; Orientation: Straight; Height: 14.73mm; Contact Plating: Gold; Series: KK® 6410; Number of Poles: 5; Mount: Through Hole; Length: 12.7mm; Packaging: Bulk; Package Quantity: 10; Depth: 5.8mm; Housing Color: White; Pitch: 2.54mm; Number of Positions: 5; Contact Mating Length: 0.295inch; Max Operating Temperature: 75°C; Housing Material: Nylon; Termination: Solder; Contact Material: Brass; Flammability Rating: UL94 V-0; Number of Contacts: 5; Color: Natural; Min Operating Temperature: 0°C; Radiation Hardening: No; Contact Type: Male Pin; Number of Rows: 1; Voltage Rating: 250V; Voltage Rating (DC): 250V; Contact Gender: Male; Fastening Type: Friction; Lead Free: Lead Free; Halogen Free: Low Halogen
U3 = CMP-0243-00216-1: ARM Cortex-M4 32-bit MCU+FPU, 256 KB Flash, 128 KB Internal RAM, 50 I/Os, 64-Pin LQFP, -40 to 85 degC, Tray; Operating Frequency(F) (Processor speed) (MHz): 180; Internal RAM Size (kB): 128; I/Os (High Current): 50; FLASH Size (Prog) (kB): 256; D/A Converter: 2; Supply Voltage(Vcc) min (V): 1.7; Mounting Technology: Surface Mount; DatasheetVersion: Rev. 6; ComponentLink1URL: http://www.st.com/; Package Description: LQFP64; ComponentLink1Description: Manufacturer URL; Packing: Tray; ComponentLink2Description: Datasheet; Core: ARM Cortex-M4; Package Reference: 64-Pin Low-profile Quad Flat Package, Body 10 x 10 mm, Pitch 0.5 mm; ComponentLink2URL: http://www.st.com/st-web-ui/static/active/en/resource/technical/document/datasheet/DM00141306.pdf
Y1 = 9C-8.000MBBK-T: CRYSTAL 8.0000MHZ 20PF SMD; Manufacturer: TXC CORPORATION; ESR (Equivalent Series Resistance): 80 Ohms; Frequency Stability: ±50ppm; Operating Mode: Fundamental; Part Number: 9C-8.000MBBK-T; ComponentLink1Description: Datasheet; ComponentLink1URL: http://www.txccorp.com/download/products/quartz_crystals/2015TXC_9C_32.pdf; ComponentLink2Description: DigiKey Link; ComponentLink2URL: http://digikey.com/product-detail/en/txc-corporation/9C-8.000MBBK-T/887-2475-1-ND/4475454; Frequency: 8MHz; Frequency Tolerance: ±50ppm; Height - Seated (Max): 0.161" (4.10mm); LastUpdated: 6/3/2024 8:02:24 PM; Lifecycle Status: Active; Load Capacitance: 20pF; Minimum Order: 1; Mounting Type: Surface Mount; Operating Temperature: -20°C ~ 70°C; Package / Case: HC-49S; Packaging: TapeAndReel; PartId: 697; Part Status: Active; Price: 0.18; Series: 9C; Size / Dimension: 0.449" L x 0.189" W (11.40mm x 4.80mm); Supplier 1: DigiKey; Supplier Part Number 1: 887-2475-1-ND; Type: MHz Crystal; Value: 8MHz

## Sheet USBC.SchDoc
size A4; SheetNumber: 3; SheetTotal: 4
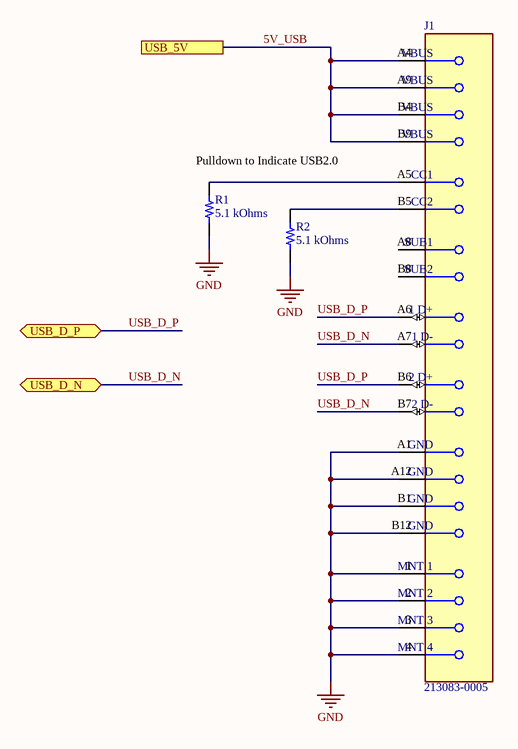
[diagram p3: USBC.SchDoc]

### Parts
J1  213083-0005  [FP-2130830005-MFG]
R1  5.1 kOhms  [RES 0603_1608]
R2  5.1 kOhms  [RES 0603_1608]

### Ports
USB_5V, USB_D_N (bidir), USB_D_P (bidir)

### Nets
GND: J1.1(MNT_1) J1.2(MNT_2) J1.3(MNT_3) J1.4(MNT_4) J1.A1(GND) J1.A12(GND) J1.B1(GND) J1.B12(GND) R1.1 R2.1
5V_USB: J1.A4(VBUS) J1.A9(VBUS) J1.B4(VBUS) J1.B9(VBUS) ; port USB_5V
USB_D_N: J1.A7(1_D-) J1.B7(2_D-) ; port USB_D_N
USB_D_P: J1.A6(1_D+) J1.B6(2_D+) ; port USB_D_P
NetJ1_A5: J1.A5(CC1) R1.2
NetJ1_B5: J1.B5(CC2) R2.2

Not connected (* = marked no-connect by the designer): J1 A8(SUB1) B8(SUB2)

### Notes on the sheet
- (near R1) Pulldown to Indicate USB2.0

### Library data of the parts
J1 = CMP-04767-000030-2: CONN RCP USB2.0 TYP C 24P SMD RA; NexarPartId: 114105384; Current Rating: 5A; Number of Contacts: 16; Voltage Rating: 30V; Gender: Receptacle; Min Operating Temperature: -40°C; USB Standard: USB 2.0; Max Operating Temperature: 85°C; Contact Material: Gold, Nickel; Schedule B: 8536695050, 8536695050; Country of Origin: CN
R1 R2 = TNPW06035K10BYEN: RES 5.1K OHM 0.1% 1/10W 0603; Manufacturer: Vishay Dale; Power (Watts): 0.125W, 1/8W; Temperature Coefficient: ±10ppm/°C; Part Number: TNPW06035K10BYEN; Value: 5.1 kOhms; ComponentLink1Description: Datasheet; ComponentLink1URL: http://www.vishay.com/docs/28758/tnpw_e3.pdf; ComponentLink2Description: DigiKey Link; ComponentLink2URL: http://digikey.com/product-detail/en/vishay-dale/TNPW06035K10BYEN/541-9831-1-ND/9562456; Composition: Thin Film; Device Package: 0603 (1608 Metric); Features: Anti-Sulfur, Automotive AEC-Q200, Moisture Resistant; Height - Seated (Max): 0.022" (0.55mm); LastUpdated: 2/9/2024 8:43:35 PM; Lifecycle Status: Active; Minimum Order: 1; Number of Terminations: 2; Operating Temperature: -55°C ~ 155°C; Package / Case: 0603 (1608 Metric); Packaging: TapeAndReel; PartId: 5273; Part Status: Active; Price: 0.27; Ratings: AEC-Q200; Resistance: 5.1 kOhms; Series: TNPW e3; Size / Dimension: 0.061" L x 0.033" W (1.55mm x 0.85mm); Supplier 1: DigiKey; Supplier Part Number 1: 541-9831-1-ND; Supplier Device Package: 0603; Tolerance: ±0.1%

## Nets that join several sheets
3V3: POWER (5 pins), MCU (16 pins)
5V_SYS: POWER (C1.2 C2.2 U1.3 U4.7), MCU (J2.5 J5.5 J8.1)
26V0: TOP (MP1.1), POWER (8 pins)
GND: TOP (J4.2 MP2.1), POWER (26 pins), MCU (28 pins), USBC (10 pins)
5V_BUCK: TOP (J4.1), POWER (9 pins)
5V_USB: POWER (U4.6), MCU (R7.2), USBC (J1.A4 J1.A9 J1.B4 J1.B9)
NetRbot_1: POWER (Rbot.1 Rtop.2), MCU (U3.8)
USB_D_N: MCU (U3.44), USBC (J1.A7 J1.B7)
USB_D_P: MCU (U3.45), USBC (J1.A6 J1.B6)